# EasyEDA Pro project talking_train.epro

# Schematic Schematic1
Board Name: Board1; Create Date: 2026-04-15; Page Name: P1; Project Name: TalkingTrainV2; Schematic Name: Schematic1; Update Date: 2026-04-15; Company: Felix.Ink; Page Size: A2; Version: V1.0
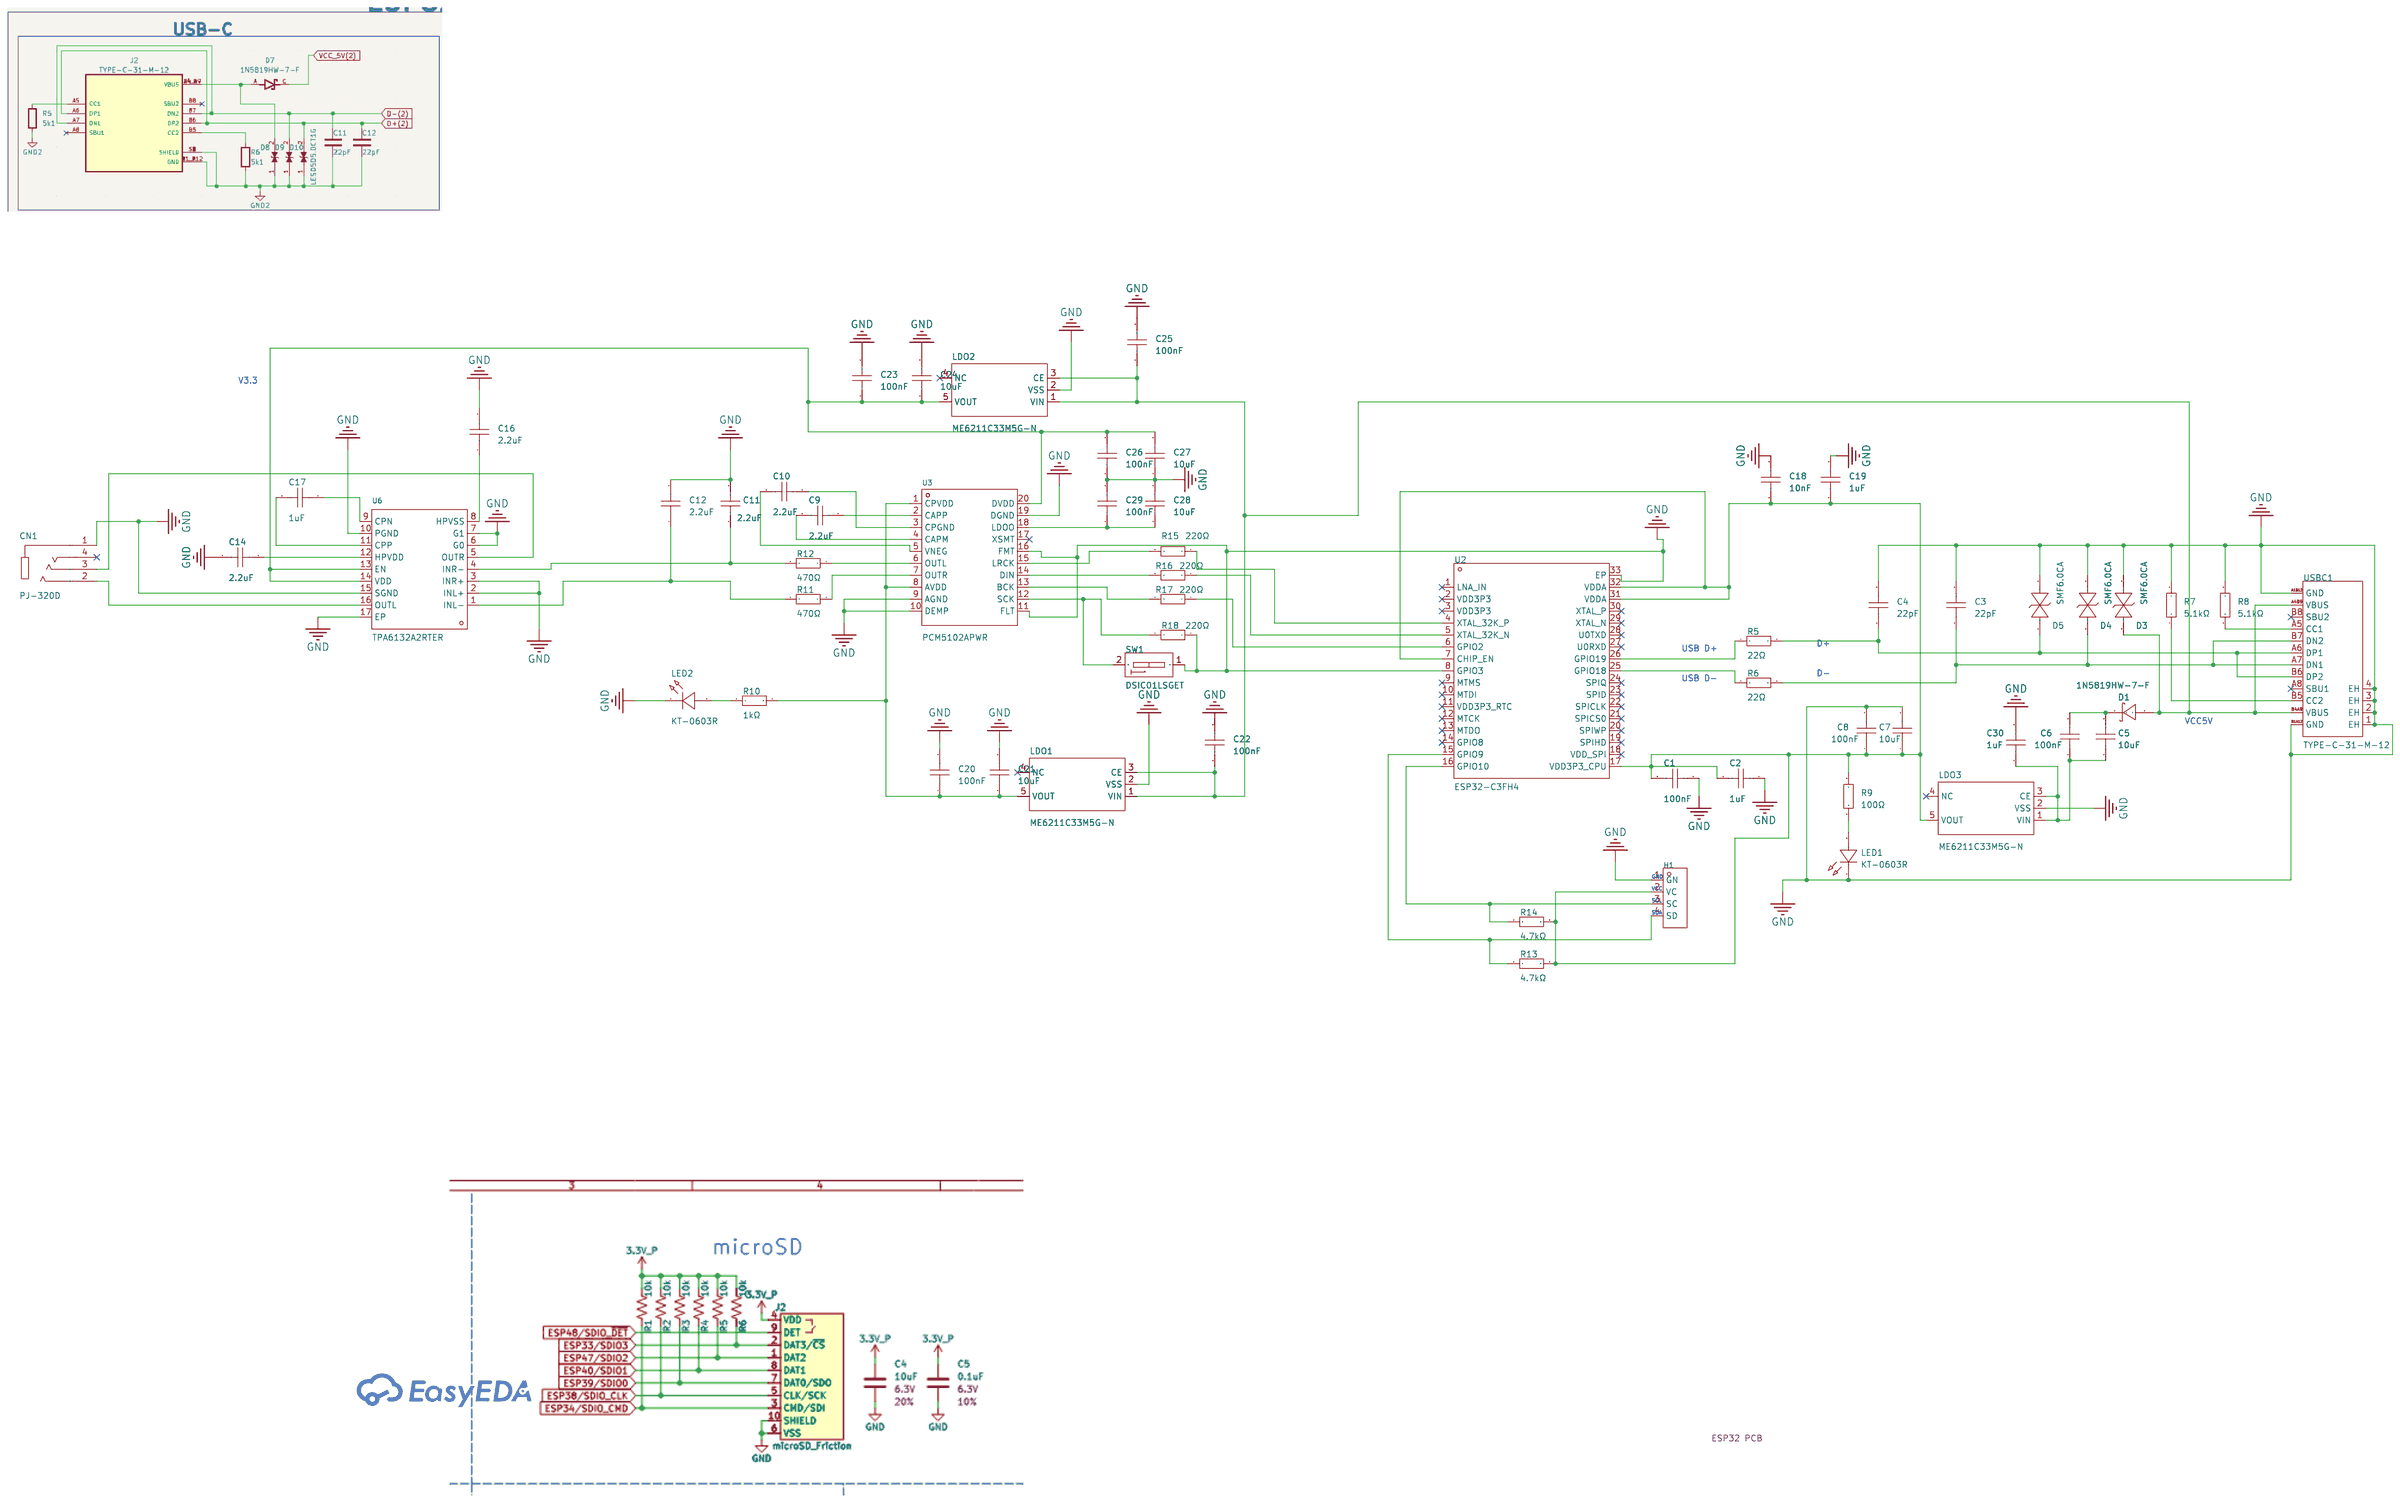
[diagram p0: schematic sheet]

## Parts
C1  100nF  [C0603]
C2  1uF  [C0603]
C3  22pF  [C0603]
C4  22pF  [C0603]
C5  10uF  [C0603]
C6  100nF  [C0603]
C7  10uF  [C0603]
C8  100nF  [C0603]
C9  2.2uF  [C0603]
C10  2.2uF  [C0603]
C11  2.2uF  [C0603]
C12  2.2uF  [C0603]
C14  2.2uF  [C0603]
C16  2.2uF  [C0603]
C17  1uF  [C0603]
C18  10nF  [C0603]
C19  1uF  [C0603]
C20  100nF  [C0603]
C21  10uF  [C0603]
C22  100nF  [C0603]
C23  100nF  [C0603]
C24  10uF  [C0603]
C25  100nF  [C0603]
C26  100nF  [C0603]
C27  10uF  [C0603]
C28  10uF  [C0603]
C29  100nF  [C0603]
C30  1uF  [C1206]
CN1  PJ-320D  [AUDIO-SMD_PJ-320D-1]
D1  1N5819HW-7-F  [SOD-123_L2.7-W1.6-LS3.7-RD]
D3  SMF6.0CA  [SOD-123FL_L2.7-W1.8-LS3.8-BI]
D4  SMF6.0CA  [SOD-123FL_L2.7-W1.8-LS3.8-BI]
D5  SMF6.0CA  [SOD-123FL_L2.7-W1.8-LS3.8-BI]
H1  2.54-1*4P母  [HDR-TH_4P-P2.54-V-F]
LDO1  ME6211C33M5G-N  [SOT-23-5_L3.0-W1.7-P0.95-LS2.8-BL]
LDO2  ME6211C33M5G-N  [SOT-23-5_L3.0-W1.7-P0.95-LS2.8-BL]
LDO3  ME6211C33M5G-N  [SOT-23-5_L3.0-W1.7-P0.95-LS2.8-BL]
LED1  KT-0603R  [LED0603-RD]
LED2  KT-0603R  [LED0603-RD]
R5  22Ω  [R0603]
R6  22Ω  [R0603]
R7  5.1kΩ  [R0805]
R8  5.1kΩ  [R0805]
R9  100Ω  [R0603]
R10  1kΩ  [R0603]
R11  470Ω  [R0603]
R12  470Ω  [R0603]
R13  4.7kΩ  [R0603]
R14  4.7kΩ  [R0603]
R15  220Ω  [R0603]
R16  220Ω  [R0603]
R17  220Ω  [R0603]
R18  220Ω  [R0603]
SW1  DSIC01LSGET  [SW-SMD_DSIC01LSGET]
U2  ESP32-C3FH4  [QFN-32_L5.0-W5.0-P0.50-TL-EP3.7]
U3  PCM5102APWR  [TSSOP-20_L6.5-W4.4-P0.65-LS6.4-BL]
U6  TPA6132A2RTER  [WQFN-16_L3.0-W3.0-P0.50-TL-EP1.6]
USBC1  TYPE-C-31-M-12  [USB-C_SMD-TYPE-C-31-M-12_1]

## Library data of the parts
C1 C6 C8 C20 C22 C23 C25 C26 C29 = CC0603KRX7R9BB104: Capacitance:100nF Tolerance:±10% Tolerance:±10% Voltage Rating:50V Temperature Coefficient:X7R; LCSC Part Name: 100nF ±10% 50V; Supplier Part: C14663; Manufacturer: YAGEO(国巨); Supplier Footprint: 0603; JLCPCB Part Class: Basic Part; Datasheet: https://item.szlcsc.com/datasheet/CC0603KRX7R9BB104/15331.html; Supplier: LCSC; Tolerance: ±10%; Voltage Rating: 50V; Temperature Coefficient: X7R
C2 C17 C19 = CL10A105KB8NNNC: Capacitance:1uF Tolerance:±10% Tolerance:±10% Voltage Rating:50V Temperature Coefficient:X5R; LCSC Part Name: 1uF ±10% 50V; Supplier Part: C15849; Manufacturer: SAMSUNG(三星); Supplier Footprint: 0603; JLCPCB Part Class: Basic Part; Datasheet: https://item.szlcsc.com/datasheet/CL10A105KB8NNNC/16531.html; Supplier: LCSC; Tolerance: ±10%; Voltage Rating: 50V; Temperature Coefficient: X5R
C3 C4 = CL10C220JB8NNNC: Capacitance:22pF Tolerance:±5% Tolerance:±5% Voltage Rating:50V Temperature Coefficient:C0G; LCSC Part Name: 22pF ±5% 50V; Supplier Part: C1653; Manufacturer: SAMSUNG(三星); Supplier Footprint: 0603; JLCPCB Part Class: Basic Part; Datasheet: https://item.szlcsc.com/datasheet/CL10C220JB8NNNC/2005.html; Supplier: LCSC; Tolerance: ±5%; Voltage Rating: 50V; Temperature Coefficient: C0G
C5 C7 C21 C24 C27 C28 = CL10A106KP8NNNC: Capacitance:10uF Tolerance:±10% Tolerance:±10% Voltage Rating:10V Temperature Coefficient:X5R; LCSC Part Name: 10uF ±10% 10V; Supplier Part: C19702; Manufacturer: SAMSUNG(三星); Supplier Footprint: 0603; JLCPCB Part Class: Basic Part; Datasheet: https://item.szlcsc.com/datasheet/CL10A106KP8NNNC/20411.html; Supplier: LCSC; Tolerance: ±10%; Voltage Rating: 10V; Temperature Coefficient: X5R
C9-C12 C14 C16 = CL10A225KO8NNNC: Capacitance:2.2uF Tolerance:±10% Tolerance:±10% Voltage Rating:16V Temperature Coefficient:X5R; LCSC Part Name: 2.2uF ±10% 16V; Supplier Part: C23630; Manufacturer: SAMSUNG(三星); Supplier Footprint: 0603; JLCPCB Part Class: Basic Part; Datasheet: https://item.szlcsc.com/datasheet/CL10A225KO8NNNC/24366.html; Supplier: LCSC; Tolerance: ±10%; Voltage Rating: 16V; Temperature Coefficient: X5R
C18 = 0603B103K500NT: Capacitance:10nF Tolerance:±10% Tolerance:±10% Voltage Rating:50V Temperature Coefficient:X7R; LCSC Part Name: 10nF ±10% 50V; Supplier Part: C57112; Manufacturer: FH(风华); Supplier Footprint: 0603; JLCPCB Part Class: Basic Part; Datasheet: https://item.szlcsc.com/datasheet/0603B103K500NT/58143.html; Supplier: LCSC; Tolerance: ±10%; Voltage Rating: 50V; Temperature Coefficient: X7R
C30 = CL31B105KBHNNNE: Capacitance:1uF Tolerance:±10% Tolerance:±10% Voltage Rating:50V Temperature Coefficient:X7R; LCSC Part Name: 1uF ±10% 50V; Supplier Part: C1848; Manufacturer: SAMSUNG(三星); Supplier Footprint: 1206; JLCPCB Part Class: Basic Part; Datasheet: https://item.szlcsc.com/datasheet/CL31B105KBHNNNE/2200.html; Supplier: LCSC; Tolerance: ±10%; Voltage Rating: 50V; Temperature Coefficient: X7R
CN1 = PJ-320D_C431535: Connector Type:3.5mm Headphone Jack Current Rating:1A Voltage Rating (Max):12V Contact Material:Copper Contact Plating:Gold Operating Temperature:-30℃~+70℃ Operating Temperature:-30℃~+70℃; LCSC Part Name: 3.5mm耳机座; Supplier Part: C431535; Manufacturer: SHOU HAN(首韩); Supplier Footprint: SMD; JLCPCB Part Class: Extended Part; Datasheet: https://item.szlcsc.com/datasheet/PJ-320D/427892.html; Supplier: LCSC; Connector Type: 3.5mm Headphone Jack; Current Rating: 1A; Voltage Rating (Max): 12V; Contact Material: Copper; Contact Plating: Gold; Operating Temperature: -30℃~+70℃
D1 = 1N5819HW-7-F: Diode Configuration:1 Independent Voltage - Forward(Vf@If):450mV@1A Voltage - DC Reverse(Vr):40V Current - Rectified:1A Reverse Leakage Current (Ir):1mA@40V Operating Junction Temperature Range:-65℃~+150℃ Operating Junction Temperature Range:-65℃~+150℃ No; LCSC Part Name: 电压:40V 电流:1A; Supplier Part: C82544; Manufacturer: DIODES(美台); Supplier Footprint: SOD-123; JLCPCB Part Class: Extended Part; Datasheet: https://item.szlcsc.com/datasheet/1N5819HW-7-F/83701.html; Supplier: LCSC; Diode Configuration: 1 Independent; Voltage - Forward(Vf@If): 450mV@1A; Voltage - DC Reverse(Vr): 40V; Current - Rectified: 1A; Reverse Leakage Current (Ir): 1mA@40V; Operating Junction Temperature Range: -65℃~+150℃; Non-Repetitive Peak Forward Surge Current: 25A
D3-D5 = SMF6.0CA_C19077500: Polarity:Bidirectional Reverse Stand-Off Voltage (Vrwm):6V Clamping Voltage:10.3V Peak Pulse Current (Ipp):19.4A@10/1000us Peak Pulse Power Dissipation (Ppp):200W@10/1000us Voltage - Breakdown:7.37V Reverse Leakage Current (Ir):400uA Number of Channels:1; LCSC Part Name: 双向TVS 6V截止 峰值浪涌电流：19.4A@10/1000us; Supplier Part: C19077500; Manufacturer: R+O(宏嘉诚); Supplier Footprint: SOD-123FL; JLCPCB Part Class: Extended Part; Datasheet: https://item.szlcsc.com/datasheet/SMF6.0CA/20275585.html; Supplier: LCSC; Polarity: Bidirectional; Reverse Stand-Off Voltage (Vrwm): 6V; Clamping Voltage: 10.3V; Peak Pulse Current (Ipp): 19.4A@10/1000us; Peak Pulse Power Dissipation (Ppp): 200W@10/1000us; Voltage - Breakdown: 7.37V; Reverse Leakage Current (Ir): 400uA; Number of Channels: 1; Operating Temperature: -55℃~+150℃; level of protection: IEC 61000-4-2; Type: TVS
H1 = 2.54-1*4P母: Holes Structure:1x4P Pitch:2.54mm Row Spacing:- Circular Hole / Square Hole:Square Hole Mounting Type:Through Hole Number of Rows:1 Number of Positions:4P Current Rating:3A Voltage Rating (Max):- Holes Direction:Top Insulation Height:- Contact Material:Br; Supplier: LCSC; Supplier Part: C2718488; Manufacturer: BOOMELE(博穆精密); JLCPCB Part Class: Extended Part; LCSC Part Name: 间距:2.54mm 1x4P 直插; Supplier Footprint: 插件,P=2.54mm; Datasheet: https://item.szlcsc.com/datasheet/2.54-1*4P%25E6%25AF%258D/2834502.html; Holes Structure: 1x4P; Pitch: 2.54mm; Circular Hole / Square Hole: Square Hole; Mounting Type: Through Hole; Number of Rows: 1; Number of Positions: 4P; Current Rating: 3A; Holes Direction: Top; Contact Material: Bronze; Operating Temperature: -40℃~+105℃
LDO1-LDO3 = ME6211C33M5G-N: Output Type:Fixed Voltage - Supply:6V Output Voltage:3.3V Output Voltage:3.3V Output Current:500mA Power Supply Rejection Ratio (PSRR):70dB@(1kHz) Voltage Dropout:120mV@(100mA) standby current:60uA Noise:50uVrms Features:Over Current Protection；Enable；Sho; LCSC Part Name: 输入6V 输出3.3V 500mA; Supplier Part: C82942; Manufacturer: MICRONE(南京微盟); Supplier Footprint: SOT-23-5; JLCPCB Part Class: Extended Part; Datasheet: https://item.szlcsc.com/datasheet/ME6211C33M5G-N/84106.html; Supplier: LCSC; Output Type: Fixed; Voltage - Supply: 6V; Output Voltage: 3.3V; Output Current: 500mA; Power Supply Rejection Ratio (PSRR): 70dB@(1kHz); Voltage Dropout: 120mV@(100mA); standby current: 60uA; Noise: 50uVrms; Features: Over Current Protection；Enable；Short Circuit Protection; Operating Temperature: -40℃~+150℃; Output Configuration: Positive; Number of Outputs: 1
LED1 LED2 = KT-0603R: Lamp Holder Type:- Illumination Color:Red Voltage - Forward(Vf):1.8V~2.4V Voltage - Forward(Vf):1.8V~2.4V Power(Watts):40mW Forward Current:20mA Wavelength - Dominant:615nm~630nm Wavelength - Dominant:615nm~630nm Peak Wavelength:645nm Diode Configuration:; LCSC Part Name: 0603 红灯 高亮; Supplier Part: C2286; Manufacturer: KENTO; Supplier Footprint: 0603; JLCPCB Part Class: Basic Part; Datasheet: https://item.szlcsc.com/datasheet/KT-0603R/2659.html; Supplier: LCSC; Illumination Color: Red; Voltage - Forward(Vf): 1.8V~2.4V; Power(Watts): 40mW; Forward Current: 20mA; Wavelength - Dominant: 615nm~630nm; Peak Wavelength: 645nm; Diode Configuration: Discrete Diode; Lens Color: Water Clear; Luminous Intensity: 300mcd; Viewing Angle: 120°; Operating Temperature: -40℃~+85℃
R5 R6 = 0603WAF220JT5E: Type:Thick Film Resistors Resistance:22Ω Tolerance:±1% Tolerance:±1% Power(Watts): Overload Voltage (Max): Temperature Coefficient:±100ppm/℃ Temperature Coefficient:±100ppm/℃ Operating Temperature Range:-55℃~+155℃ Operating Temperature Range:-55℃~+155℃; LCSC Part Name: 22Ω ±1% 100mW 厚膜电阻; Supplier Part: C23345; Manufacturer: UNI-ROYAL(厚声); Supplier Footprint: 0603; JLCPCB Part Class: Basic Part; Datasheet: https://atta.szlcsc.com/upload/public/pdf/source/20200306/C422600_1E6D84923E4A46A82E41ADD87F860B5C.pdf; Supplier: LCSC; Type: Thick Film Resistors; Tolerance: ±1%; Temperature Coefficient: ±100ppm/℃; Operating Temperature Range: -55℃~+155℃
R7 R8 = 0805W8F5101T5E: Type:Thick Film Resistor Resistance:5.1kΩ Tolerance:±1% Tolerance:±1% Power(Watts):125mW Voltage-Supply(Max):150V Temperature Coefficient:±100ppm/℃ Temperature Coefficient:±100ppm/℃ Operating Temperature:-55℃~+155℃ Operating Temperature:-55℃~+155℃; LCSC Part Name: 5.1kΩ ±1% 125mW 厚膜电阻; Supplier Part: C27834; Manufacturer: UNI-ROYAL(厚声); Supplier Footprint: 0805; JLCPCB Part Class: Basic Part; Datasheet: https://item.szlcsc.com/datasheet/0805W8F5101T5E/28584.html; Supplier: LCSC; Type: Thick Film Resistor; Tolerance: ±1%; Power(Watts): 125mW; Voltage-Supply(Max): 150V; Temperature Coefficient: ±100ppm/℃; Operating Temperature: -55℃~+155℃
R9 = 0603WAF1000T5E: Type:Thick Film Resistors Resistance: Tolerance:±1% Tolerance:±1% Power(Watts): Overload Voltage (Max): Temperature Coefficient:±200ppm/℃ Temperature Coefficient:±200ppm/℃ Operating Temperature Range:-55℃~+155℃ Operating Temperature Range:-55℃~+155℃; LCSC Part Name: 100Ω ±1% 100mW 厚膜电阻; Supplier Part: C22775; Manufacturer: UNI-ROYAL(厚声); Supplier Footprint: 0603; JLCPCB Part Class: Basic Part; Datasheet: https://atta.szlcsc.com/upload/public/pdf/source/20200306/C422600_1E6D84923E4A46A82E41ADD87F860B5C.pdf; Supplier: LCSC; Type: Thick Film Resistors; Tolerance: ±1%; Temperature Coefficient: ±200ppm/℃; Operating Temperature Range: -55℃~+155℃
R10 = 0603WAF1001T5E: Type:Thick Film Resistor Resistance:1kΩ Tolerance:±1% Tolerance:±1% Power(Watts):100mW Voltage-Supply(Max):75V Temperature Coefficient:±100ppm/℃ Temperature Coefficient:±100ppm/℃ Operating Temperature:-55℃~+155℃ Operating Temperature:-55℃~+155℃; LCSC Part Name: 1kΩ ±1% 100mW 厚膜电阻; Supplier Part: C21190; Manufacturer: UNI-ROYAL(厚声); Supplier Footprint: 0603; JLCPCB Part Class: Basic Part; Datasheet: https://item.szlcsc.com/datasheet/0603WAF1001T5E/21904.html; Supplier: LCSC; Type: Thick Film Resistor; Tolerance: ±1%; Power(Watts): 100mW; Voltage-Supply(Max): 75V; Temperature Coefficient: ±100ppm/℃; Operating Temperature: -55℃~+155℃
R11 R12 = 0603WAF4700T5E: Type:Thick Film Resistor Resistance:470Ω Tolerance:±1% Tolerance:±1% Power(Watts):100mW Voltage-Supply(Max):75V Temperature Coefficient:±100ppm/℃ Temperature Coefficient:±100ppm/℃ Operating Temperature:-55℃~+155℃ Operating Temperature:-55℃~+155℃; LCSC Part Name: 470Ω ±1% 100mW 厚膜电阻; Supplier Part: C23179; Manufacturer: UNI-ROYAL(厚声); Supplier Footprint: 0603; JLCPCB Part Class: Basic Part; Datasheet: https://item.szlcsc.com/datasheet/0603WAF4700T5E/23906.html; Supplier: LCSC; Type: Thick Film Resistor; Tolerance: ±1%; Power(Watts): 100mW; Voltage-Supply(Max): 75V; Temperature Coefficient: ±100ppm/℃; Operating Temperature: -55℃~+155℃
R13 R14 = 0603WAF4701T5E: Type:Thick Film Resistor Resistance:4.7kΩ Tolerance:±1% Tolerance:±1% Power(Watts):100mW Voltage-Supply(Max):75V Temperature Coefficient:±100ppm/℃ Temperature Coefficient:±100ppm/℃ Operating Temperature:-55℃~+155℃ Operating Temperature:-55℃~+155℃; LCSC Part Name: 4.7kΩ ±1% 100mW 厚膜电阻; Supplier Part: C23162; Manufacturer: UNI-ROYAL(厚声); Supplier Footprint: 0603; JLCPCB Part Class: Basic Part; Datasheet: https://item.szlcsc.com/datasheet/0603WAF4701T5E/23889.html; Supplier: LCSC; Type: Thick Film Resistor; Tolerance: ±1%; Power(Watts): 100mW; Voltage-Supply(Max): 75V; Temperature Coefficient: ±100ppm/℃; Operating Temperature: -55℃~+155℃
R15-R18 = 0603WAF2200T5E: Type:Thick Film Resistors Resistance: Tolerance:±1% Tolerance:±1% Power(Watts): Overload Voltage (Max): Temperature Coefficient:±100ppm/℃ Temperature Coefficient:±100ppm/℃ Operating Temperature Range:-55℃~+155℃ Operating Temperature Range:-55℃~+155℃; LCSC Part Name: 220Ω ±1% 100mW 厚膜电阻; Supplier Part: C22962; Manufacturer: UNI-ROYAL(厚声); Supplier Footprint: 0603; JLCPCB Part Class: Basic Part; Datasheet: https://atta.szlcsc.com/upload/public/pdf/source/20200306/C422600_1E6D84923E4A46A82E41ADD87F860B5C.pdf; Supplier: LCSC; Type: Thick Film Resistors; Tolerance: ±1%; Temperature Coefficient: ±100ppm/℃; Operating Temperature Range: -55℃~+155℃
SW1 = DSIC01LSGET: Type:Slide, Rocked Circuit:SPST Number of Positions:1 Lead Pitch:- Operating Life:- Color:Black; LCSC Part Name: 1位高推 拨码开关; Supplier Part: C54948; Manufacturer: YE; Supplier Footprint: SMD; JLCPCB Part Class: Extended Part; Datasheet: https://item.szlcsc.com/datasheet/DSIC01LSGET/55973.html; Supplier: LCSC; Type: Slide, Rocked; Circuit: SPST; Number of Positions: 1; Color: Black
U2 = ESP32-C3FH4: LCSC Part Name: 不带固件 ESP32-C3 是一款低功耗、高集成度的 MCU 系统级芯片 (SoC)，集成 2.4 GHz Wi-Fi 和低功耗蓝牙 (Bluetooth® LE) 无线通信。; Supplier Part: C2858491; Manufacturer: ESPRESSIF(乐鑫); Supplier Footprint: QFN-32-EP(5x5); JLCPCB Part Class: Extended Part; Datasheet: https://item.szlcsc.com/datasheet/ESP32-C3FH4/3060870.html; Supplier: LCSC
U3 = PCM5102APWR: Interface Type:PCM Supply Voltage:1.65V~3.46V Supply Voltage:1.65V~3.46V Number of Channels:2 Resolution:24；16；32 Operating Temperature:-25℃~+85℃ Operating Temperature:-25℃~+85℃; Supplier Part: C107671; Manufacturer: TI(德州仪器); Supplier Footprint: TSSOP-20; JLCPCB Part Class: Extended Part; Datasheet: https://www.ti.com/cn/lit/gpn/pcm5102a; Supplier: LCSC; Interface Type: PCM; Supply Voltage: 1.65V~3.46V; Number of Channels: 2; Resolution: 24；16；32; Operating Temperature: -25℃~+85℃
U6 = TPA6132A2RTER: Type of Power Amplifier:AB类功放 Speaker Channels:双声道 Output Power: Supply Voltage:2.3V~5.5V Supply Voltage:2.3V~5.5V Operating Temperature:-40℃~+85℃ Operating Temperature:-40℃~+85℃; Supplier Part: C69901; Manufacturer: TI(德州仪器); Supplier Footprint: WQFN-16-EP(3x3); JLCPCB Part Class: Extended Part; Datasheet: https://www.ti.com/cn/lit/gpn/tpa6132a2; Supplier: LCSC; Type of Power Amplifier: AB类功放; Speaker Channels: 双声道; Supply Voltage: 2.3V~5.5V; Operating Temperature: -40℃~+85℃
USBC1 = TYPE-C-31-M-12: Connector Type:Type-C Protocol Standard:- Gender:Female Mounting Type:Surface Mount, Right Angle Number of Contacts:16P Number of Ports:1 Current Rating-Power:5A Voltage Rating:20V Connect-Disconnect Life:10,000 cycles Length:7.35mm Operating Temperature:; LCSC Part Name: Type-C 母 卧贴; Supplier Part: C165948; Manufacturer: 韩国韩荣; Supplier Footprint: SMD; JLCPCB Part Class: Extended Part; Datasheet: https://item.szlcsc.com/datasheet/TYPE-C-31-M-12/177331.html; Supplier: LCSC; Connector Type: Type-C; Gender: Female; Mounting Type: Surface Mount, Right Angle; Number of Contacts: 16P; Number of Ports: 1; Current Rating-Power: 5A; Voltage Rating: 20V; Connect-Disconnect Life: 10,000 cycles; Length: 7.35mm; Operating Temperature: -30℃~+80℃

## Nets
GND: C1.1 C2.1 C3.2 C4.2 C7.2 C8.2 C11.2 C12.2 C14.1 C16.2 C18.1 C19.1 C20.2 C21.2 C22.2 C23.2 C24.2 C25.2 C26.1 C27.1 C28.2 C29.2 C30.2 CN1.1 D3.1 D4.1 D5.1 H1.1(GN) LDO1.2(VSS) LDO2.2(VSS) LDO3.2(VSS) LED1.1(K) LED2.1(K) R7.2 R8.2 R18.1 SW1.1(A1) U2.8(GPIO3) U2.33(EP) U3.9(AGND) U3.10(DEMP) U3.11(FLT) U3.16(FMT) U3.19(DGND) U6.2(INL+) U6.3(INR+) U6.6(G0) U6.7(G1) U6.10(PGND) U6.15(SGND) U6.17(EP) USBC1.1(EH) USBC1.2(EH) USBC1.3(EH) USBC1.4(EH) USBC1.A1B12(GND) USBC1.B1A12(GND)
$1N1802: H1.3(SC) R14.1 U2.16(GPIO10)
$1N1808: H1.4(SD) R13.1 U2.15(GPIO9)
$1N2174: R5.1 U2.26(GPIO19)
$1N2178: R6.1 U2.25(GPIO18)
$1N2608: R7.1 USBC1.B5(CC2)
$1N2732: R8.1 USBC1.A5(CC1)
$1N3437: C22.1 C25.1 D1.2(A) D3.2 LDO1.1(VIN) LDO1.3(CE) LDO2.1(VIN) LDO2.3(CE) USBC1.A4B9(VBUS) USBC1.B4A9(VBUS)
$1N3484: C3.1 D4.2 R6.2 USBC1.A7(DN1) USBC1.B7(DN2)
$1N3488: C4.1 D5.2 R5.2 USBC1.A6(DP1) USBC1.B6(DP2)
$1N4706: C5.1 C6.1 C30.1 LDO3.1(VIN) LDO3.3(CE)
$1N4804: C5.2 C6.2 D1.1(K)
$1N5192: LED1.2(A) R9.1
$1N6728: C9.1 U3.2(CAPP)
$1N6732: C9.2 U3.4(CAPM)
$1N6738: C10.1 U3.3(CPGND)
$1N6815: LED2.2(A) R10.2
$1N6838: R12.1 U3.6(OUTL)
$1N6938: R11.1 U3.7(OUTR)
$1N7742: CN1.3 U6.5(OUTR)
$1N7752: CN1.2 U6.16(OUTL)
$1N8430: C14.2 U6.12(HPVDD)
$1N8534: C16.1 U6.8(HPVSS)
$1N8599: C17.1 U6.9(CPN)
$1N8604: C17.2 U6.11(CPP)
$1N10130: C1.2 C2.2 C7.1 C8.1 C18.2 C19.2 H1.2(VC) LDO3.5(VOUT) R9.2 R13.2 R14.2 U2.7(CHIP_EN) U2.17(VDD3P3_CPU) U2.31(VDDA) U2.32(VDDA)
$1N10789: C20.1 C21.1 LDO1.5(VOUT) R10.1 U3.1(CPVDD) U3.8(AVDD)
$1N11578: C23.1 C24.1 C26.2 C27.2 LDO2.5(VOUT) U3.20(DVDD) U6.13(EN) U6.14(VDD)
$1N11814: C28.1 C29.1 U3.18(LDOO)
$1N12011: R15.2 U3.15(LRCK)
$1N12041: R16.2 U3.14(DIN)
$1N12085: R17.2 U3.13(BCK)
$1N12091: R18.2 SW1.2(A2) U3.12(SCK)
$1N12135: R17.1 U2.6(GPIO2)
$1N12139: R16.1 U2.5(XTAL_32K_N)
$1N12143: R15.1 U2.4(XTAL_32K_P)
$1N12295: C10.2 U3.5(VNEG)
$1N24434: C12.1 R11.2 U6.1(INL-)
$1N24441: C11.1 R12.2 U6.4(INR-)

Not connected (* = marked no-connect by the designer): CN1 4*; LDO1 4(NC)*; LDO2 4(NC)*; LDO3 4(NC)*; U2 1(LNA_IN)* 2(VDD3P3)* 3(VDD3P3)* 9(MTMS)* 10(MTDI)* 11(VDD3P3_RTC)* 12(MTCK)* 13(MTDO)* 14(GPIO8)* 18(VDD_SPI)* 19(SPIHD)* 20(SPIWP)* 21(SPICS0)* 22(SPICLK)* 23(SPID)* 24(SPIQ)* 27(U0RXD)* 28(U0TXD)* 29(XTAL_N)* 30(XTAL_P)*; U3 17(XSMT)*; USBC1 A8(SBU1)* B8(SBU2)*

## Notes on the sheet
- V3.3
- D+
- USB D+
- D-
- USB D-
- VCC5V
- GND
- VCC
- SCL
- SDA

# Board PCB3
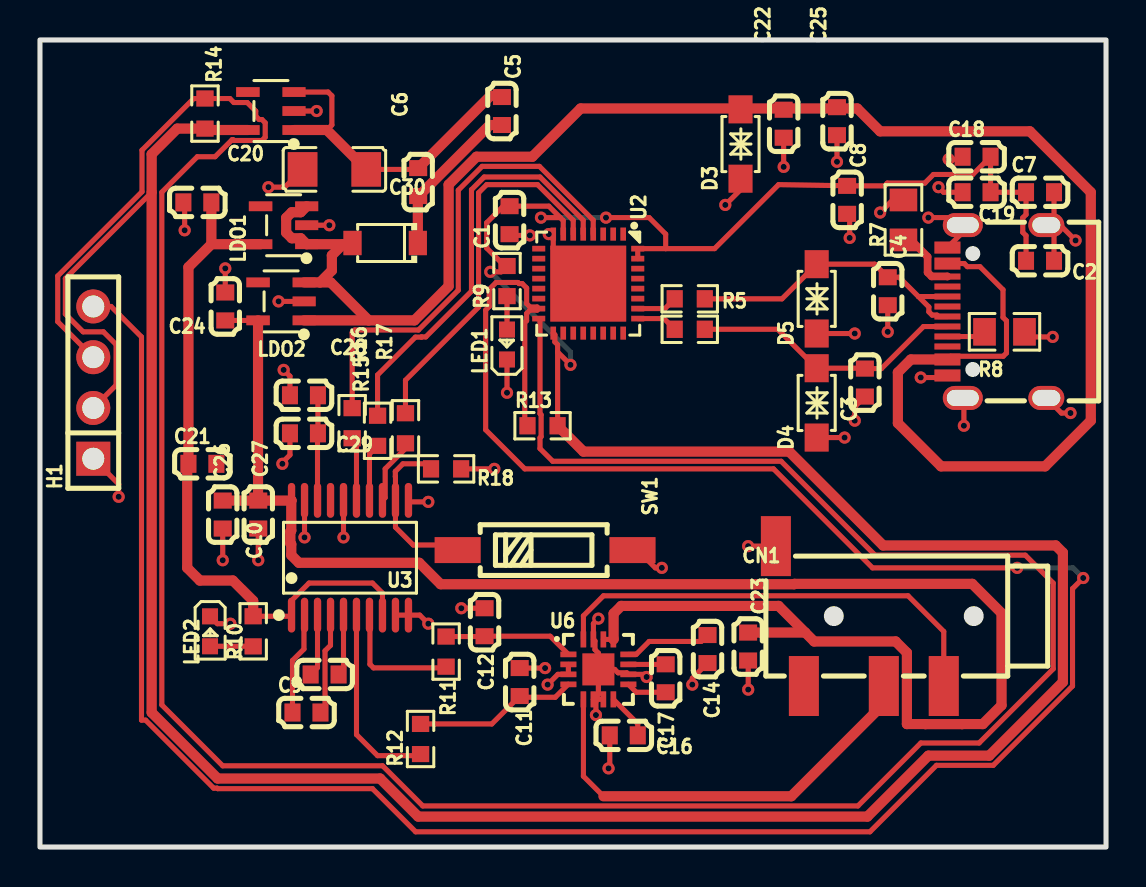
[diagram p1: board, top side]
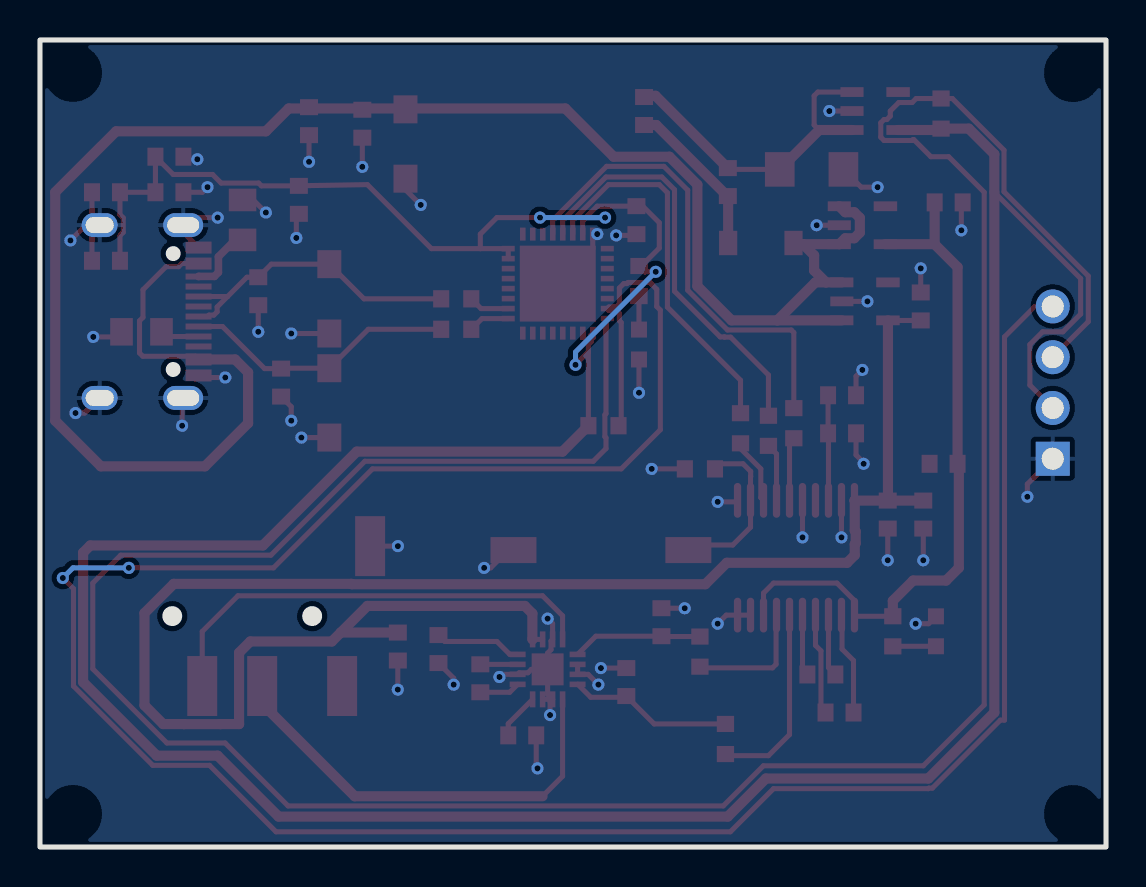
[diagram p2: board, bottom side, seen from below]

Outline 53.34 x 40.39 mm; copper layers: Top Layer, Bottom Layer. Coordinates in mm from the lower left corner of the outline.
Outline path: rectangle 0,40.39 53.34,0
Stack: Top Layer 0.035mm / Dielectric1 1.51mm FR4 er 4.5 / Bottom Layer 0.035mm

## Design rules (mm)
template: JLCPCB Capability(Two Layers Board)
spacing copperThickness1oz (default): track to track 0.102, other pairs 0.152 to 0.3
spacing copperThickness2oz: track to track 0.203, other pairs 0.152 to 0.3
track width copperThickness1oz (default): min 0.127, default 0.254, max 2.54
track width copperThickness2oz: min 0.203, default 0.254, max 2.54
differential pair differentialPair (default): width min 0.127, default 0.254, max 2.54; gap min 0.152, default 0.152
via viaSize (default): diameter min 0.5, default 0.61, max 10; hole min 0.3, default 0.305, max 6.3

## Placement (name value [footprint] x y rotation side)
C1  100nF  [C0603]  23.5 31.37 90 top
C2  1uF  [C0603]  50.04 29.34 180 top
C3  22pF  [C0603]  41.28 23.24 270 top
C4  22pF  [C0603]  42.42 27.81 270 top
C5  10uF  [C0603]  23.11 36.83 270 top
C6  100nF  [C0603]  18.92 33.27 270 top
C7  10uF  [C0603]  50.04 32.77 0 top
C8  100nF  [C0603]  40.39 32.38 270 top
C9  2.2uF  [C0603]  13.34 6.73 0 top
C10  2.2uF  [C0603]  14.24 8.63 0 top
C11  2.2uF  [C0603]  24 8.25 90 top
C12  2.2uF  [C0603]  22.24 11.25 90 top
C14  2.2uF  [C0603]  33.4 9.91 90 top
C16  2.2uF  [C0603]  29.21 5.59 180 top
C17  1uF  [C0603]  31.31 8.44 90 top
C18  10nF  [C0603]  46.86 34.54 0 top
C19  1uF  [C0603]  46.86 32.77 0 top
C20  100nF  [C0603]  7.87 32.26 180 top
C21  10uF  [C0603]  8.13 19.18 0 top
C22  100nF  [C0603]  37.21 36.19 270 top
C23  100nF  [C0603]  35.43 10.03 270 top
C24  10uF  [C0603]  9.27 27.05 90 top
C25  100nF  [C0603]  39.88 36.32 270 top
C26  100nF  [C0603]  9.14 16.64 90 top
C27  10uF  [C0603]  10.92 16.64 90 top
C28  10uF  [C0603]  13.21 22.61 180 top
C29  100nF  [C0603]  13.21 20.7 180 top
C30  1uF  [C1206]  14.73 33.91 180 top
CN1  PJ-320D  [AUDIO-SMD_PJ-320D-1]  41.02 11.56 180 top
D1  1N5819HW-7-F  [SOD-123_L2.7-W1.6-LS3.7-RD]  17.27 30.23 180 top
D3  SMF6.0CA  [SOD-123FL_L2.7-W1.8-LS3.8-BI]  35.05 35.18 90 top
D4  SMF6.0CA  [SOD-123FL_L2.7-W1.8-LS3.8-BI]  38.86 22.22 90 top
D5  SMF6.0CA  [SOD-123FL_L2.7-W1.8-LS3.8-BI]  38.86 27.43 90 top
H1  2.54-1*4P母  [HDR-TH_4P-P2.54-V-F]  2.67 23.24 90 top
LDO1  ME6211C33M5G-N  [SOT-23-5_L3.0-W1.7-P0.95-LS2.8-BL]  12.19 31.11 90 top
LDO2  ME6211C33M5G-N  [SOT-23-5_L3.0-W1.7-P0.95-LS2.8-BL]  12.06 27.3 90 top
LDO3  ME6211C33M5G-N  [SOT-23-5_L3.0-W1.7-P0.95-LS2.8-BL]  11.56 36.83 90 top
LED1  KT-0603R  [LED0603-RD]  23.37 25.15 90 top
LED2  KT-0603R  [LED0603-RD]  8.51 10.79 270 top
R5  22Ω  [R0603]  32.51 27.43 0 top
R6  22Ω  [R0603]  32.51 25.91 0 top
R7  5.1kΩ  [R0805]  43.2 31.38 90 top
R8  5.1kΩ  [R0805]  48.26 25.78 0 top
R9  100Ω  [R0603]  23.37 28.32 90 top
R10  1kΩ  [R0603]  10.67 10.79 270 top
R11  470Ω  [R0603]  20.32 9.78 90 top
R12  470Ω  [R0603]  19.04 5.41 90 top
R13  4.7kΩ  [R0603]  25.15 21.08 0 top
R14  4.7kΩ  [R0603]  8.25 36.7 270 top
R15  220Ω  [R0603]  15.62 21.21 270 top
R16  220Ω  [R0603]  16.89 20.83 270 top
R17  220Ω  [R0603]  18.29 20.95 270 top
R18  220Ω  [R0603]  20.32 18.92 180 top
SW1  DSIC01LSGET  [SW-SMD_DSIC01LSGET]  25.27 14.86 270 top
U2  ESP32-C3FH4  [QFN-32_L5.0-W5.0-P0.50-TL-EP3.7]  27.43 28.19 270 top
U3  PCM5102APWR  [TSSOP-20_L6.5-W4.4-P0.65-LS6.4-BL]  15.51 14.48 0 top
U6  TPA6132A2RTER  [WQFN-16_L3.0-W3.0-P0.50-TL-EP1.6]  27.94 8.89 0 top
USBC1  TYPE-C-31-M-12  [USB-C_SMD-TYPE-C-31-M-12_1]  47.88 26.8 90 top

## Footprints (pads in the part's own frame, mm; a bottom-side part is the same pattern mirrored in y, then rotated)
AUDIO-SMD_PJ-320D-1
  rect 1.5x3 smd: 1(4.2,-3.5) 2(-4.2,3.5) 3(-1.2,3.5) 4(2.8,3.5)
C0603
  rect 0.8x0.9 smd: 1(-0.7,0) 2(0.7,0)
C1206
  rect 1.485x1.728 smd: 1(-1.593,0) 2(1.593,0)
HDR-TH_4P-P2.54-V-F
  rect 1.7x1.7 hole 1.1: 1(-3.81,0)
  round 1.7 hole 1.1: 2(-1.27,0) 3(1.27,0) 4(3.81,0)
LED0603-RD
  rect 0.8x0.8 smd: 1(-0.749,0) 2(0.749,0)
QFN-32_L5.0-W5.0-P0.50-TL-EP3.7
  rect 0.65x0.28 smd: 1(-2.478,1.75) 2(-2.478,1.25) 3(-2.478,0.75) 4(-2.478,0.25) 5(-2.478,-0.25) 6(-2.478,-0.75) 7(-2.478,-1.25) 8(-2.478,-1.75) 17(2.478,-1.75) 18(2.478,-1.25) 19(2.478,-0.75) 20(2.478,-0.25) 21(2.478,0.25) 22(2.478,0.75) 23(2.478,1.25) 24(2.478,1.75)
  rect 0.28x0.65 smd: 9(-1.75,-2.478) 10(-1.25,-2.478) 11(-0.75,-2.478) 12(-0.25,-2.478) 13(0.25,-2.478) 14(0.75,-2.478) 15(1.25,-2.478) 16(1.75,-2.478) 25(1.75,2.478) 26(1.25,2.478) 27(0.75,2.478) 28(0.25,2.478) 29(-0.25,2.478) 30(-0.75,2.478) 31(-1.25,2.478) 32(-1.75,2.478)
  rect 3.8x3.8 smd: 33(0,0)
R0603
  rect 0.806x0.864 smd: 1(-0.753,0) 2(0.753,0)
R0805
  rect 1.133x1.377 smd: 1(-1,0) 2(1,0)
SOD-123_L2.7-W1.6-LS3.7-RD
  rect 0.91x1.22 smd: 1(-1.635,0) 2(1.635,0)
SOD-123FL_L2.7-W1.8-LS3.8-BI
  rect 1.4x1.2 smd: 1(-1.735,0) 2(1.735,0)
SOT-23-5_L3.0-W1.7-P0.95-LS2.8-BL
  rect 0.49x1.157 smd: 1(-0.95,-1.153) 2(0,-1.153) 3(0.95,-1.153)
  rect 0.49x1.175 smd: 4(0.95,1.153) 5(-0.95,1.153)
SW-SMD_DSIC01LSGET
  rect 1.3x2.3 smd: 1(0,4.375) 2(0,-4.375)
TSSOP-20_L6.5-W4.4-P0.65-LS6.4-BL
  oval 0.364x1.742 smd: 1(-2.925,-2.871) 2(-2.275,-2.871) 3(-1.625,-2.871) 4(-0.975,-2.871) 5(-0.325,-2.871) 6(0.325,-2.871) 7(0.975,-2.871) 8(1.625,-2.871) 9(2.275,-2.871) 10(2.925,-2.871) 11(2.925,2.871) 12(2.275,2.871) 13(1.625,2.871) 14(0.975,2.871) 15(0.325,2.871) 16(-0.325,2.871) 17(-0.975,2.871) 18(-1.625,2.871) 19(-2.275,2.871) 20(-2.925,2.871)
USB-C_SMD-TYPE-C-31-M-12_1
  oval 1.2x2 hole 0.8x1.6: 1(4.325,1.706) 4(-4.325,1.706)
  oval 1.2x1.8 hole 0.8x1.4: 2(4.325,-2.474) 3(-4.325,-2.474)
  custom 0.6x1.3 smd: A1B12(-3.2,2.474) A4B9(-2.4,2.474) B1A12(3.2,2.474) B4A9(2.401,2.474)
  rect 0.3x1.3 smd: A5(-1.25,2.474) A6(-0.25,2.474) A7(0.25,2.474) A8(1.25,2.474) B5(1.75,2.474) B6(0.75,2.474) B7(-0.75,2.474) B8(-1.75,2.474)
WQFN-16_L3.0-W3.0-P0.50-TL-EP1.6
  rect 0.8x0.28 smd: 1(-1.5,0.749) 2(-1.5,0.249) 3(-1.5,-0.249) 4(-1.5,-0.75) 9(1.5,-0.75) 10(1.5,-0.249) 11(1.5,0.249) 12(1.5,0.749)
  rect 0.28x0.8 smd: 5(-0.749,-1.5) 6(-0.249,-1.5) 7(0.249,-1.5) 8(0.75,-1.5) 13(0.75,1.5) 14(0.249,1.5) 15(-0.249,1.5) 16(-0.749,1.5)
  rect 1.6x1.6 smd: 17(0,0)

## Nets
As in the schematic.

Pads without a net: CN1 4; LDO1 4; LDO2 4; LDO3 4; U2 1 2 3 9 10 11 12 13 14 18 19 20 21 22 23 24 27 28 29 30; U3 17; USBC1 A8 B8

## Via types
v1: diameter 0.61, hole 0.305, Top Layer to Bottom Layer, 54 vias

## Routing (per net, layer and track width the routed paths; a pad name or vN(x,y) marks a point on that pad's centre or on a via; arc(x,y) is an arc through that point)
GND: length 82.4
  Top Layer w0.254: C22.2 v1(37.21,34.04) ; v1(19.43,17.27) 18.51,17.27 U3.11 ; LDO1.2 v1(14.48,31.11) ; 8.51,11.54 8.88,11.18 v1(9.53,11.18) ; v1(27.82,6.6) 27.82,7.26 U6.6 ; U3.19 v1(13.24,15.49) ; LDO2.2 v1(11.94,27.3) ; CN1.1 v1(35.43,15.06) ; v1(3.94,17.53) 3.94,18.16 H1.1 ; 35.69,9.33 35.44,9.08 v1(35.44,7.88) ; U6.6 U6.7 ; U6.6 27.94,7.64 U6.17 ; v1(25.46,30.67) U2.8 25.68,29.94 U2.33 ; C4.2 v1(42.42,25.78) ; C29.2 12.51,19.62 12.06,19.18 ; C1.1 23.56,30.61 v1(24.51,30.61) ; v1(45.47,34.42) 46.04,34.42 C18.1 ; C20.2 7.24,32.19 v1(7.24,30.86) ; C12.2 v1(21.08,11.95) ; U6.17 28.75,8.89 28.92,8.72 29.36,8.72 U6.10 30.22,8.64 v1(30.35,8.51) ; U6.17 27.94,9.7 27.77,9.87 27.77,10.31 U6.15 27.69,11.18 v1(27.94,11.43) ; v1(51.56,21.72) 51.11,21.72 USBC1.3 ; C26.1 v1(9.14,14.35) ; v1(25.4,8.13) 25.91,8.64 U6.3 U6.2 ; C2.1 50.74,30.74 50.35,31.12 ; v1(40.77,21.34) 40.77,22.03 C3.2 ; 50.35,31.12 50.74,31.51 C7.2 ; 50.35,31.12 51.05,31.12 v1(51.82,30.35) ; USBC1.B1A12 46.17,30.77 46.17,31.12 45.8,31.5 v1(44.45,31.5) ; v1(19.43,11.18) 19,11.61 U3.10 U3.9 ; v1(44.07,23.49) 45.3,23.49 USBC1.A1B12 ; v1(11.43,33.02) 12.25,33.02 C30.2 ; C19.1 45.21,32.77 v1(44.96,33.02) ; LDO3.2 v1(13.84,36.83) ; v1(40.51,30.48) 40.51,31.56 C8.2 ; v1(12.19,23.88) 12.51,23.56 C28.2 ; C11.2 v1(25.27,8.95) ; v1(28.45,3.94) 28.51,4 28.51,5.59 ; 29.65,15.11 30.79,13.97 v1(31.12,13.97) ; v1(46.23,21.08) 46.23,22.42 USBC1.4 ; D3.1 35.05,32.89 v1(34.29,32.13) ; D5.1 v1(40.77,25.7) ; 49.51,25.53 v1(50.67,25.53) ; v1(42.04,31.75) 42.67,32.38 R7.2 ; U3.16 v1(15.19,15.49) ; R18.1 v1(22.73,18.92) ; C14.1 32.64,8.44 v1(32.64,8.13) ; D4.1 v1(40.26,20.49) ; C25.2 v1(39.88,34.29) ; LED1.1 v1(23.37,22.73) ; C24.2 v1(9.27,28.96) ; C27.1 v1(10.92,14.35)
  vias: v1(12.13,19.18)
$1N1802: length 142.3
  Top Layer w0.254: H1.3 0.89,26.29 0.89,28.57 5.1,32.79 5.1,34.87 7.69,37.46 R14.1 9.5,37.46 9.7,37.26 10.37,37.26 10.79,36.83 10.79,36.58 10.97,36.4 11.11,36.4 11.27,36.24 11.27,35.52 11.11,35.36 9.7,35.36 9.66,35.4 9.62,35.4 8.76,34.54 7.87,34.54 6.1,32.77 6.1,7.11 9.14,4.06 17.15,4.06 19.15,2.06 40.93,2.06 44.08,5.21 46.99,5.21 50.7,8.91 50.7,13.21 49.3,14.6 41.78,14.6 37.08,19.3 25.65,19.3 25.02,19.94 25.02,20.48 25.07,20.53 25.07,21.63 25.02,21.69 25.02,26.38 U2.16
$1N1808: length 129.9
  Top Layer w0.254: H1.4 3.56,27.05 5.08,25.53 5.08,6.35 5.29,6.35 8.69,2.95 8.87,2.95 8.89,2.92 16.64,2.92 18.8,0.76 41.53,0.76 44.86,4.09 47.7,4.09 51.66,8.05 51.66,12.93 v1(52.2,13.46) ; R13.1 24.26,21.22 24.26,26.25 24.35,26.34 24.35,26.7 24.51,26.86 24.87,26.86 U2.15 24.87,27.02 24.51,27.02 24.35,27.19 24.35,27.97 24.13,28.19 23.97,28.19 23.92,28.25 22.82,28.25 22.48,27.91 22.48,27.05 22.3,26.87 22.3,20.88 24.26,18.92 36.7,18.92 41.66,13.97 v1(48.9,13.97)
  Bottom Layer w0.254: v1(52.2,13.46) 51.69,13.97 v1(48.9,13.97)
$1N2174: length 2.1
  Top Layer w0.254: U2.26 31.27,26.94 R5.1
$1N2178: length 2.1
  Top Layer w0.254: U2.25 31.22,26.44 R6.1
$1N2608: length 3.4
  Top Layer w0.381: USBC1.B5 45.4,28.55 44.61,28.55 44.41,28.76 44.41,29.54 43.57,30.38 R7.1
$1N2732: length 2.1
  Top Layer w0.254: 47.51,25.53 47.49,25.55 USBC1.A5
$1N3437: length 98.3
  Top Layer w0.254: USBC1.B4A9 46.25,29.2 46.4,29.04 47.03,29.04 48.19,27.89 48.19,26.5 48.36,26.33 48.36,24.72 48.2,24.56 45.57,24.56 USBC1.A4B9
  Top Layer w0.508: 15.16,30.16 14.6,29.61 14.6,28.85 14.01,28.25 ; 15.16,30.16 15.58,30.16 D1.2 ; 15.16,30.16 LDO1.1 13.05,30.46 12.6,30.46 12.32,30.74 12.32,31.49 12.6,31.77 13.05,31.77 LDO1.3 ; 16.44,26.35 14.54,28.25 14.01,28.25 ; 16.44,26.35 18.74,26.35 20.45,28.06 20.45,33.15 21.84,34.54 24.64,34.54 27.05,36.96 40.89,36.96 42.04,35.81 49.53,35.81 52.58,32.77 52.58,21.34 50.29,19.05 45.09,19.05 42.93,21.21 42.93,23.75 43.57,24.4 USBC1.A4B9 ; 16.44,26.35 LDO2.1 ; 14.01,28.25 LDO2.3
$1N3484: length 13.8
  Top Layer w0.254: USBC1.B7 44.21,26.05 42.1,23.94 C3.1 41.26,23.96 D4.2 36.91,25.91 R6.2
$1N3488: length 15.5
  Top Layer w0.254: 43.95,27.55 USBC1.B6 ; 43.95,27.55 42.99,28.51 C4.1 41.76,29.17 D5.2 37.13,27.43 R5.2 ; 43.95,27.55 44.48,27.02 44.48,26.78 44.64,26.62 44.88,26.62 44.95,26.55 USBC1.A6
$1N4706: length 16.5
  Top Layer w0.254: LDO3.3 14.42,37.78 14.6,37.59 14.6,36.13 14.35,35.88 ; C30.1 18.86,33.91
  Top Layer w0.508: C30.1 14.35,35.88 LDO3.1 ; 23.11,37.53 23.05,37.59 22.54,37.59 C6.1
$1N4804: length 8
  Top Layer w0.508: C5.2 22.5,36.13 18.95,32.57 C6.2 18.91,32.56 D1.1
$1N5192: length 1.7
  Top Layer w0.254: LED1.2 R9.1
$1N6728: length 5.1
  Top Layer w0.254: C9.1 12.63,9.33 13.21,9.91 13.21,11.58 U3.2
$1N6732: length 5.1
  Top Layer w0.254: U3.4 14.54,10.09 14.26,9.82 14.26,6.96 C9.2
$1N6738: length 3.1
  Top Layer w0.254: C10.1 13.89,8.98 U3.3
$1N6815: length 2.2
  Top Layer w0.254: LED2.2 10.66,10.05 R10.2
$1N6838: length 9.2
  Top Layer w0.254: U3.6 15.84,5.63 16.89,4.57 18.67,4.57
$1N6938: length 6.4
  Top Layer w0.254: R11.1 20.26,8.96 16.69,8.96 16.51,9.14 16.51,11.58 U3.7
$1N7742: length 22.1
  Top Layer w0.254: 28.19,2.54 27.19,3.54 U6.5
  Top Layer w0.508: 28.19,2.54 37.59,2.54 42.22,7.17 CN1.3
$1N7752: length 23.1
  Top Layer w0.254: CN1.2 45.22,10.79 43.43,12.57 28.19,12.57 27.19,11.57 U6.16
$1N8430: length 4.4
  Top Layer w0.254: C14.2 33.08,10.29 30.48,10.29 29.83,9.64 U6.12
$1N8534: length 2.3
  Top Layer w0.254: U6.8 29.91,6.17 C16.1
$1N8599: length 2
  Top Layer w0.254: U6.9 29.84,7.74 C17.1
$1N8604: length 1.9
  Top Layer w0.254: U6.11 31.3,9.14 C17.2
$1N10130: length 189.5
  Top Layer w0.254: 26.03,31.5 26.18,31.35 U2.7 ; 26.03,31.5 25.46,32.07 C1.2 23.18,32.07 22.35,31.24 22.35,29.97 23.25,29.07 R9.2 23.08,28.78 v1(22.53,28.78) ; 26.03,31.5 v1(25.07,31.5) ; 31.31,29.94 33.75,29.94 36.96,33.15 40.7,33.08 ; 31.31,29.94 31.31,30.67 30.48,31.5 v1(28.32,31.5) ; 31.31,29.94 U2.32 U2.31 ; 40.7,33.08 42.26,33.08 42.4,33.23 44.28,33.23 44.7,33.65 46.67,33.65 C18.2 C19.2 49.34,32.77 49.34,31.65 49.17,31.49 49.17,30.76 49.34,30.59 49.34,29.34 ; 40.7,33.08 C8.1 ; 5.59,32.77 1.27,28.45 1.27,26.67 2.16,25.78 3.18,25.78 3.81,25.15 3.81,23.11 H1.2 ; v1(26.54,24.13) 25.9,24.77 ; 25.9,24.77 R13.2 ; 25.9,24.77 25.9,25.14 25.76,25.28 25.76,25.64 U2.17
  Top Layer w0.508: LDO3.5 8.32,35.88 R14.2 6.87,35.95 5.59,34.67 5.59,6.73 8.89,3.43 17.02,3.43 18.92,1.52 41.4,1.52 44.45,4.57 47.5,4.57 51.18,8.25 51.18,14.73 50.82,15.09 42.19,15.09 37.49,19.79 27.19,19.79 R13.2
  Bottom Layer w0.254: v1(22.53,28.78) 26.54,24.77 v1(26.54,24.13) ; v1(25.07,31.5) v1(28.32,31.5)
$1N10789: length 34.9
  Top Layer w0.254: R10.1 12.53,11.55 U3.1 12.59,12.33 13.46,13.21 16.64,13.21 17.14,12.71 U3.8
  Top Layer w0.508: 8.57,30.16 8.57,32.26 ; 8.57,30.16 7.43,29.02 C21.1 7.37,19.11 7.37,13.97 8,13.33 9.65,13.33 10.67,12.32 R10.1 ; 8.57,30.16 LDO1.5
$1N11578: length 87.2
  Top Layer w0.254: LDO2.5 10.91,26.35 C24.1 ; U6.14 U6.13
  Top Layer w0.508: 12.58,17.34 12.57,17.33 12.57,15.84 12.53,15.79 12.53,15.2 12.57,15.15 12.57,14.6 12.95,14.22 18.98,14.22 20.05,13.15 37.74,13.15 37.76,13.17 46.65,13.17 48.11,11.71 48.11,7.09 47.17,6.15 46.14,6.15 46.14,6.15 44.3,6.15 44.3,6.15 43.38,6.15 43.38,9.72 42.81,10.29 38.73,10.29 38.29,10.73 ; 12.58,17.34 C27.2 ; 12.58,17.34 U3.20 ; 38.29,10.73 35.69,10.73 ; 38.29,10.73 36.96,12.06 29.08,12.06 28.7,11.68 28.7,10.4 U6.13 ; C26.2 C27.2 ; C27.2 10.91,17.35 LDO2.5
$1N11814: length 5.4
  Top Layer w0.254: 14.1,20.76 13.89,20.55 U3.18 ; C29.1 C28.1
$1N12011: length 3.1
  Top Layer w0.254: 15.63,20.32 15.84,20.11 U3.15
$1N12041: length 2.9
  Top Layer w0.254: U3.14 16.49,19.67 R16.2
$1N12085: length 3.3
  Top Layer w0.254: U3.13 17.27,17.48 17.27,18.92 18.29,19.94 R17.2
$1N12091: length 8.3
  Top Layer w0.254: 20.9,15.11 18.68,15.11 17.79,16 U3.12 17.79,18.53 17.78,18.54 17.78,18.8 18.16,19.18 19.31,19.18 R18.2
$1N12135: length 18.9
  Top Layer w0.254: R17.1 18.29,23.36 21.95,27.02 21.95,32.74 22.35,33.15 24.9,33.15 26.68,31.36 U2.6
$1N12139: length 21
  Top Layer w0.254: U2.5 27.18,31.36 25.02,33.53 22.22,33.53 21.59,32.89 21.59,27.81 19.3,25.53 19.1,25.53 19.09,25.52 18.78,25.52 16.89,23.62 R16.1
$1N12143: length 24
  Top Layer w0.254: R15.1 15.62,25.74 15.75,25.87 18.94,25.87 20.93,27.86 20.93,32.87 22.12,34.06 24.99,34.06 27.68,31.37 U2.4
$1N12295: length 3.1
  Top Layer w0.254: C10.2 15.19,8.88 U3.5
$1N24434: length 6.5
  Top Layer w0.254: R11.2 22.23,10.53 C12.1 25.53,10.55 U6.1
$1N24441: length 8.3
  Top Layer w0.254: R12.2 22.61,6.16 C11.1 24.06,7.49 25.78,7.49 26.43,8.14 U6.4

## Copper pours and planes (outline as drawn; the poured copper is in the pictures)
GND on Bottom Layer: 0,40.39 53.34,40.39 53.34,0 0,0
(no net) on Top Layer: 59.81,38.35 64.52,38.35 64.52,35.69 59.81,35.69
(no net) on Top Layer: 59.81,38.35 64.52,38.35 64.52,35.69 59.81,35.69
(no net) on Top Layer: 59.82,40.77 60.96,40.77 60.96,39.5 59.82,39.5
(no net) on Top Layer: 63.37,40.77 64.52,40.77 64.52,39.5 63.37,39.5

## Text on the board
Top Layer: thank you hack club <3 | designed by Felix / https://felix.ink | (^◕.◕^)
